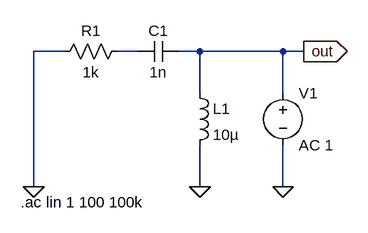
[diagram p0: schematic output-impedance.asc]
output-impedance.asc, the LTspice schematic file:
Version 4
SHEET 1 880 680
WIRE -784 -256 -832 -256
WIRE -672 -256 -704 -256
WIRE -576 -256 -608 -256
WIRE -448 -256 -576 -256
WIRE -416 -256 -448 -256
WIRE -576 -192 -576 -256
WIRE -448 -192 -448 -256
WIRE -832 -48 -832 -256
WIRE -576 -48 -576 -112
WIRE -448 -48 -448 -112
FLAG -832 -48 0
FLAG -576 -48 0
FLAG -448 -48 0
FLAG -416 -256 out
IOPIN -416 -256 Out
SYMBOL res -800 -240 R270
WINDOW 0 32 56 VTop 0
WINDOW 3 0 56 VBottom 0
SYMATTR InstName R1
SYMATTR Value 1k
SYMBOL ind -592 -208 R0
SYMATTR InstName L1
SYMATTR Value 10µ
SYMBOL cap -672 -240 R270
WINDOW 0 32 32 VTop 0
WINDOW 3 0 32 VBottom 0
SYMATTR InstName C1
SYMATTR Value 1n
SYMBOL voltage -448 -208 R0
WINDOW 123 0 0 Left 0
WINDOW 39 0 0 Left 0
SYMATTR InstName V1
SYMATTR Value AC 1
TEXT -852 -24 Left 0 !.ac lin 1 100 100k

The netlist it stands for:
* output-impedance.asc
R1 0 N001 1k
L1 out 0 10µ
C1 N001 out 1n
V1 out 0 AC 1
.ac lin 1 100 100k
.backanno
.end